# Altium project ShieldKL25zG18.PrjPcb
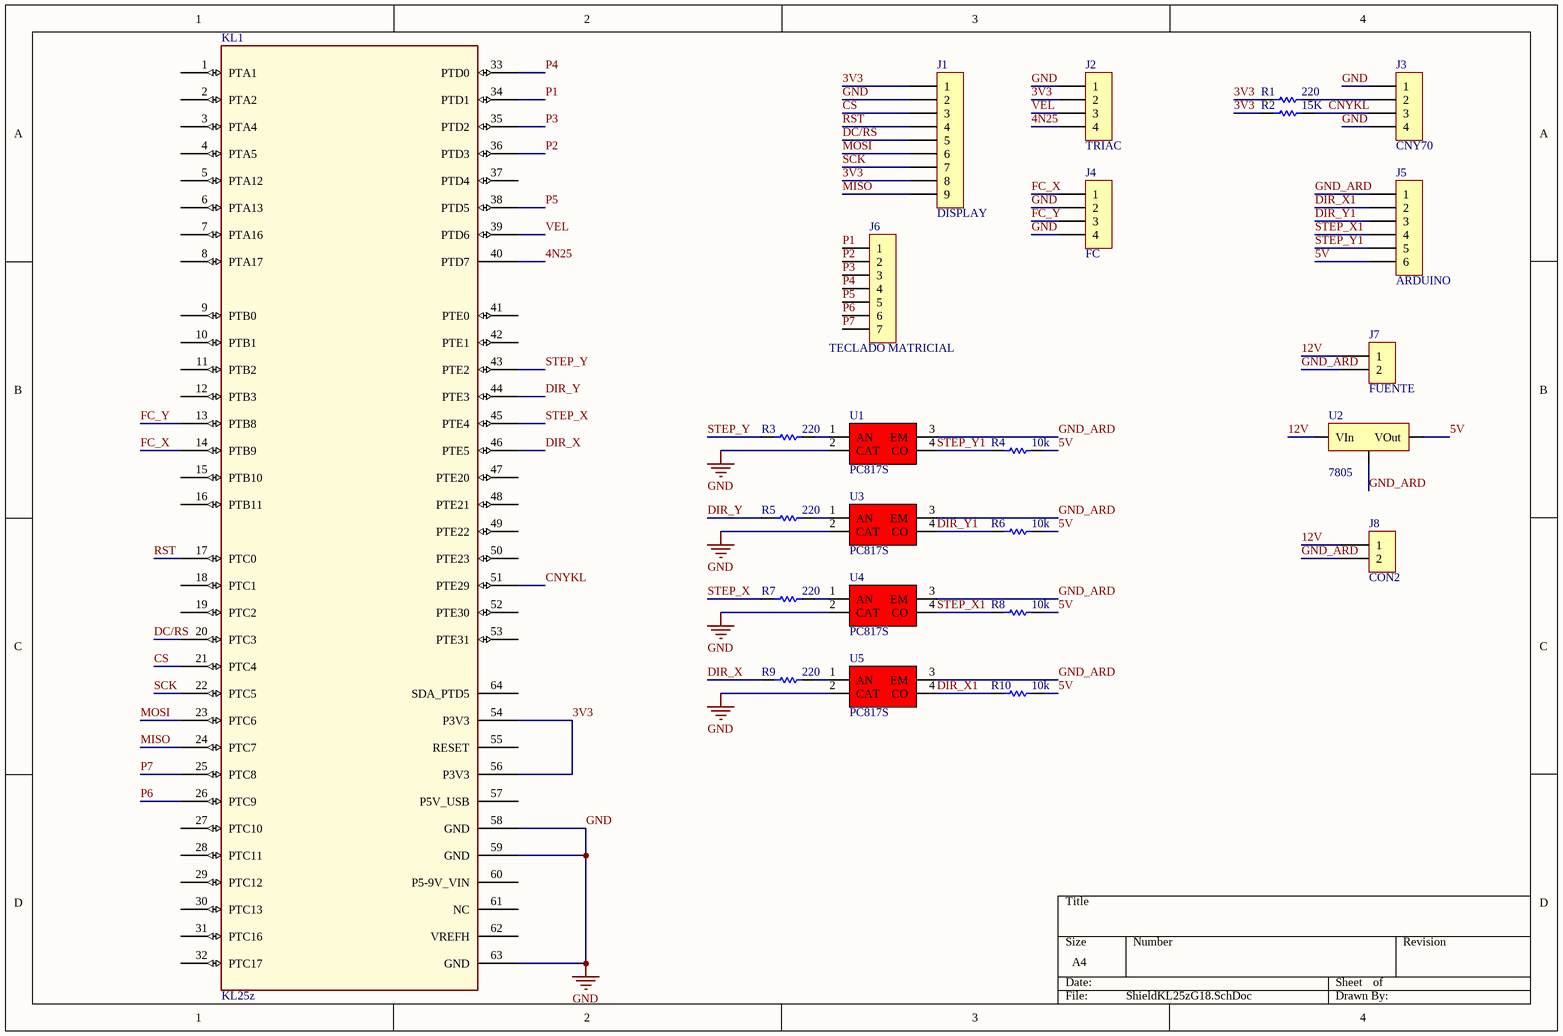
[diagram p0: ShieldKL25zG18.SchDoc]
1 sheet, 24 parts. Net scope: global (net labels, ports and power ports of the same name join across sheets).
Board files: ShieldKL25zG18.PcbDoc, ShieldKL25zG18_IMPRESION.PcbDoc

## Sheet ShieldKL25zG18.SchDoc
size A4; SheetNumber: 1; SheetTotal: 1

### Parts
J1  DISPLAY  [SIP9]
J2  TRIAC  [SIP4]
J3  CNY70  [SIP4]
J4  FC  [SIP4]
J5  ARDUINO  [SIP6]
J6  TECLADO MATRICIAL  [SIP7]
J7  FUENTE  [BORNERA2]
J8  CON2  [SIP2]
KL1  KL25z  [Freedom KL25Z Headerarray]
R1  220  [0805]
R2  15K  [0805]
R3  220  [0805]
R4  10k  [0805]
R5  220  [0805]
R6  10k  [0805]
R7  220  [0805]
R8  10k  [0805]
R9  220  [0805]
R10  10k  [0805]
U1  PC817S  [OPTO_SMD]
U2  7805  [TO-220 V]
U3  PC817S  [OPTO_SMD]
U4  PC817S  [OPTO_SMD]
U5  PC817S  [OPTO_SMD]

### Nets
GND: J1.2 J2.1 J3.1 J3.4 J4.2 J4.4 KL1.58(GND) KL1.59(GND) KL1.63(GND) U1.2(CAT) U3.2(CAT) U4.2(CAT) U5.2(CAT)
3V3: J1.1 J1.8 J2.2 KL1.54(P3V3) KL1.56(P3V3) R1.1 R2.2
4N25: J2.4 KL1.40(PTD7)
5V: J5.6 R4.2 R6.2 R8.2 R10.2 U2.3(VOut)
12V: J7.1 J8.1 U2.1(VIn)
CNYKL: J3.3 KL1.51(PTE29) R2.1
CS: J1.3 KL1.21(PTC4)
DC/RS: J1.5 KL1.20(PTC3)
DIR_X: KL1.46(PTE5) R9.1
DIR_X1: J5.2 R10.1 U5.4(CO)
DIR_Y: KL1.44(PTE3) R5.1
DIR_Y1: J5.3 R6.1 U3.4(CO)
FC_X: J4.1 KL1.14(PTB9)
FC_Y: J4.3 KL1.13(PTB8)
GND_ARD: J5.1 J7.2 J8.2 U1.3(EM) U2.2(GND) U3.3(EM) U4.3(EM) U5.3(EM)
MISO: J1.9 KL1.24(PTC7)
MOSI: J1.6 KL1.23(PTC6)
P1: J6.1 KL1.34(PTD1)
P2: J6.2 KL1.36(PTD3)
P3: J6.3 KL1.35(PTD2)
P4: J6.4 KL1.33(PTD0)
P5: J6.5 KL1.38(PTD5)
P6: J6.6 KL1.26(PTC9)
P7: J6.7 KL1.25(PTC8)
RST: J1.4 KL1.17(PTC0)
SCK: J1.7 KL1.22(PTC5)
STEP_X: KL1.45(PTE4) R7.1
STEP_X1: J5.4 R8.1 U4.4(CO)
STEP_Y: KL1.43(PTE2) R3.1
STEP_Y1: J5.5 R4.1 U1.4(CO)
VEL: J2.3 KL1.39(PTD6)
NetJ3_2: J3.2 R1.2
NetR3_2: R3.2 U1.1(AN)
NetR5_2: R5.2 U3.1(AN)
NetR7_2: R7.2 U4.1(AN)
NetR9_2: R9.2 U5.1(AN)

Not connected (* = marked no-connect by the designer): KL1 1(PTA1) 2(PTA2) 3(PTA4) 4(PTA5) 5(PTA12) 6(PTA13) 7(PTA16) 8(PTA17) 9(PTB0) 10(PTB1) 11(PTB2) 12(PTB3) 15(PTB10) 16(PTB11) 18(PTC1) 19(PTC2) 27(PTC10) 28(PTC11) 29(PTC12) 30(PTC13) 31(PTC16) 32(PTC17) 37(PTD4) 41(PTE0) 42(PTE1) 47(PTE20) 48(PTE21) 49(PTE22) 50(PTE23) 52(PTE30) 53(PTE31) 55(RESET) 57(P5V_USB) 60(P5-9V_VIN) 61(NC) 62(VREFH) 64(SDA_PTD5)

### Library data of the parts
J1 = CON9
J2-J4 = CON4
J5 = CON6
J6 = CON7
J7 = BORNERA 2
KL1 = KL25z: Creador: DONADON, Tiago; Fecha: 06/07/2022
R1-R10 = RES
U1 U3-U5 = OPTO_SMD
U2 = 78XX: REGULDOR POSITIVO